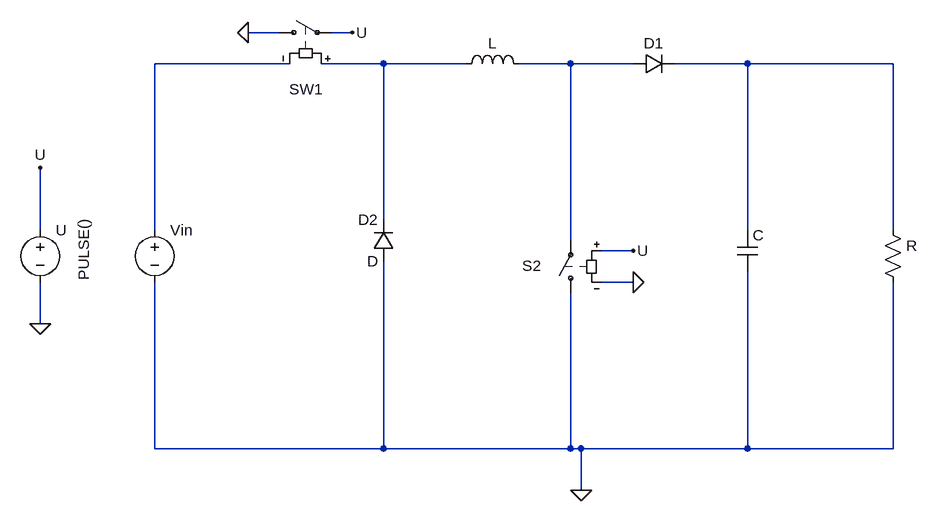
[diagram p0: schematic basic_non_inverting_buck_boost.asc]
basic_non_inverting_buck_boost.asc, the LTspice schematic file:
Version 4
SHEET 1 1616 740
WIRE -272 16 -320 16
WIRE -160 16 -192 16
WIRE -256 64 -464 64
WIRE -112 64 -208 64
WIRE 16 64 -112 64
WIRE 176 64 96 64
WIRE 272 64 176 64
WIRE 448 64 336 64
WIRE 672 64 448 64
WIRE -112 304 -112 64
WIRE -640 320 -640 224
WIRE -464 320 -464 64
WIRE 448 320 448 64
WIRE 672 320 672 64
WIRE 176 336 176 64
WIRE 272 352 224 352
WIRE 272 400 224 400
WIRE -640 464 -640 400
WIRE -464 656 -464 400
WIRE -112 656 -112 368
WIRE -112 656 -464 656
WIRE 176 656 176 416
WIRE 176 656 -112 656
WIRE 192 656 176 656
WIRE 448 656 448 384
WIRE 448 656 192 656
WIRE 672 656 672 400
WIRE 672 656 448 656
WIRE 192 720 192 656
FLAG 192 720 0
FLAG -640 224 U
FLAG -160 16 U
FLAG 272 352 U
FLAG -320 16 0
FLAG 272 400 0
FLAG -640 464 0
SYMBOL ind 0 80 R270
WINDOW 0 32 56 VTop 2
WINDOW 3 5 56 VBottom 2
SYMATTR InstName L
SYMATTR Value ""
SYMBOL cap 432 320 R0
SYMATTR InstName C
SYMATTR Value ""
SYMBOL res 656 304 R0
SYMATTR InstName R
SYMATTR Value ""
SYMBOL diode 272 80 R270
WINDOW 0 32 32 VTop 2
WINDOW 3 0 32 VBottom 2
SYMATTR InstName D1
SYMATTR Value ""
SYMBOL voltage -464 304 R0
SYMATTR InstName Vin
SYMATTR Value ""
SYMBOL diode -96 368 R180
WINDOW 0 24 64 Left 2
WINDOW 3 24 0 Left 2
SYMATTR InstName D2
SYMBOL sw -288 16 R270
WINDOW 0 -72 57 VBottom 2
SYMATTR InstName SW1
SYMATTR Value ""
SYMBOL sw 176 432 R180
WINDOW 0 45 57 Left 2
SYMATTR InstName S2
SYMATTR Value ""
SYMBOL voltage -640 304 R0
WINDOW 3 67 -1 VRight 2
WINDOW 123 0 0 Left 2
WINDOW 39 0 0 Left 2
SYMATTR InstName U
SYMATTR Value PULSE()

The netlist it stands for:
* basic_non_inverting_buck_boost.asc
L N002 N003
C N004 0
R N004 0
D1 N003 N004
Vin N001 0
D2 0 N002 D
SW1 0 U N002 N001
S2 0 N003 U 0
V§U U 0 PULSE()
.model D D
.lib standard.dio
.backanno
.end